# EAGLE schematic fonte_5v_12v (EAGLE 9.6.2)
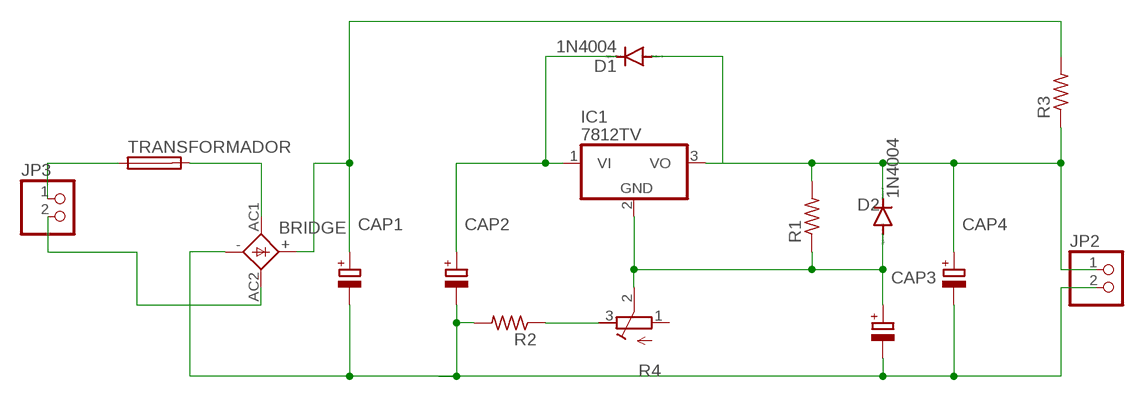
[diagram p0: schematic, sheet 1]

## Parts
BRIDGE  2KBB-R  [2KBB-R]
CAP1  CPOL-EUE5-13  [E5-13]
CAP2  CPOL-EUE5-13  [E5-13]
CAP3  CPOL-EUE5-13  [E5-13]
CAP4  CPOL-EUE5-13  [E5-13]
D1  1N4004  [DO41-10]
D2  1N4004  [DO41-10]
IC1  7812TV  [TO220V]
JP2  PINHD-1X2  [1X02]
JP3  PINHD-1X2  [1X02]
R1  R-US_0204/7  [0204/7]
R2  R-US_0204/7  [0204/7]
R3  R-US_0204/7  [0204/7]
R4  R-TRIMM3339P  [RTRIM3339P]
TRANSFORMADOR  SH22,5  [SH22,5]

## Nets
N$1: JP3.1 TRANSFORMADOR.1
N$2: BRIDGE.AC1 TRANSFORMADOR.2
N$3: CAP4.+ D1.A D2.C IC1.3(VO) JP2.1 R1.2 R3.1
N$4: BRIDGE.AC2 JP3.2
N$5: CAP2.+ D1.C IC1.1(VI)
N$6: R2.1 R4.3(E)
N$8: BRIDGE.- CAP1.- CAP2.- CAP3.- CAP4.- JP2.2 R2.2
N$9: CAP3.+ D2.A IC1.2(GND) R1.1 R4.2(S)
N$10: BRIDGE.+ CAP1.+ R3.2
Unconnected: R4.1(A)

## Library data of the parts
BRIDGE = rectifier:2KBB-R: RECTIFIER grid 3 x 5 mm
CAP1-CAP4 = rcl:CPOL-EU: POLARIZED CAPACITOR, European symbol; SPICEPREFIX: C
D1 D2 = diode:1N4004: DIODE general purpose rectifier, 1 A
IC1 = linear:78*: Positive VOLTAGE REGULATOR Source: http://cache.national.com/ds/LM/LM78L05.pdf http://www.fairchildsemi.com/ds/LM/LM7805.pdf
JP2 JP3 = pinhead:PINHD-1X2: PIN HEADER
R1-R3 = rcl:R-US_: RESISTOR, American symbol; SPICEPREFIX: R
R4 = rcl:R-TRIMM: Trimm resistor; SPICEMODEL: X; SPICEPREFIXL: POT
TRANSFORMADOR = fuse:SH22,5: FUSE HOLDER grid 22,5 mm, OGN0031 8201, Schurter (Buerklin); MF: SCHURTER; MPN: 0031.8201; OC_FARNELL: 1162740; OC_NEWARK: 96F8317